# Altium schematic sheet [05] - Master_Display.SchDoc: =ProjectName
size A4; CheckedBy: Ven; Author: Ven; CompanyName: HUST; Revision: V.1.0
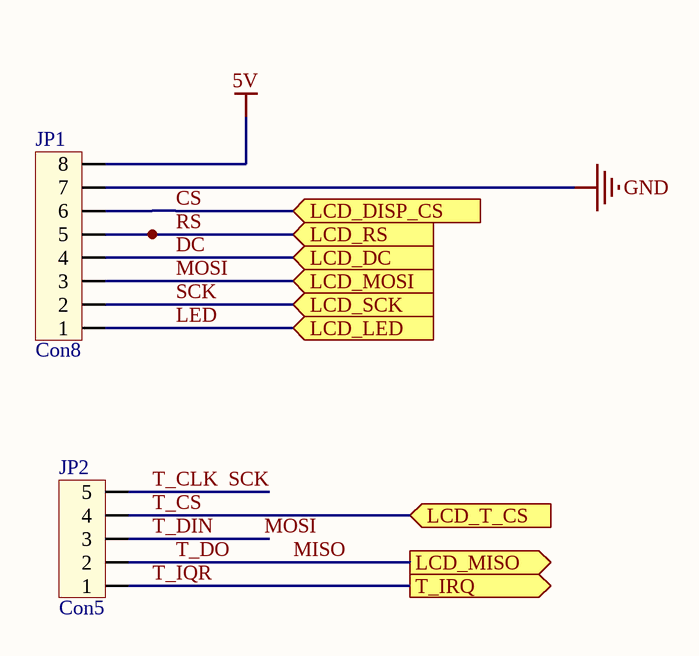
[diagram p0: [05] - Master_Display.SchDoc]

## Parts
JP1  Con8  [CON8]
JP2  Con5  [CON5]

## Ports
LCD_DC (in), LCD_DISP_CS (in), LCD_LED (in), LCD_MISO (out), LCD_MOSI (in), LCD_RS (in), LCD_SCK (in), LCD_T_CS (in), T_IRQ (out)

## Nets
5V: JP1.8
GND: JP1.7
CS: JP1.6 ; port LCD_DISP_CS
DC: JP1.4 ; port LCD_DC
LED: JP1.1 ; port LCD_LED
MISO: JP2.2 ; port LCD_MISO  [also labelled T_DO]
MOSI: JP1.3 JP2.3 ; port LCD_MOSI  [also labelled T_DIN]
RS: JP1.5 ; port LCD_RS
SCK: JP1.2 JP2.5 ; port LCD_SCK  [also labelled T_CLK]
T_CS: JP2.4 ; port LCD_T_CS
T_IQR: JP2.1 ; port T_IRQ

## Notes on the sheet
- Project:
- Page Contents:
- Size:
- Date:
- A4
- Checked by:
- Time:
- Revision:
- Sheet
- of
- File:

## Library data of the parts
JP1 = Con8: DISPLAY; Value: Connector 8
JP2 = Con5: TOUCH; Value: Connector 5